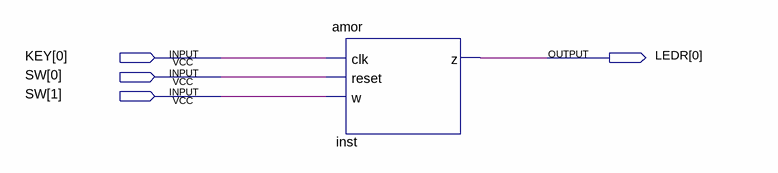
[diagram p0: schematic sheet]
// Quartus schematic MEF.bdf as structural Verilog: 1 symbols, 4 pins
module MEF (
  input  [0:0] KEY,
  input  [1:0] SW,
  output [0:0] LEDR
);

  amor inst (.clk(KEY[0]), .reset(SW[0]), .w(SW[1]), .z(LEDR[0]));
endmodule
